# Altium project esp32-loadcell.PrjPcb
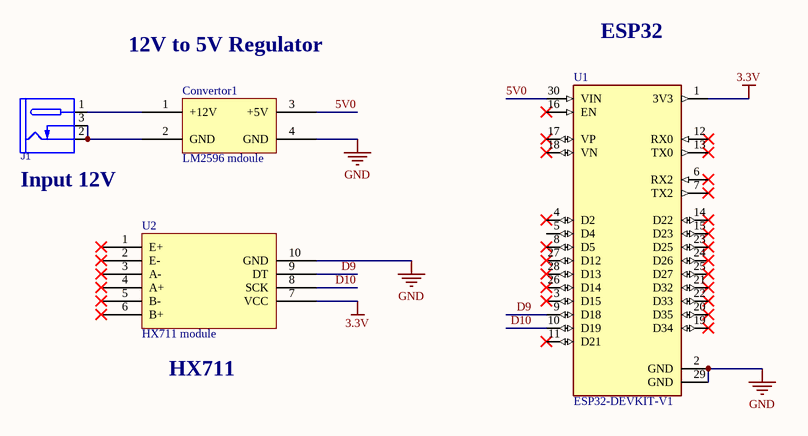
[diagram p0: Sheet1.SchDoc]
1 sheet, 4 parts. Net scope: global (net labels, ports and power ports of the same name join across sheets).
Board file: PCB1.PcbDoc

## Sheet Sheet1.SchDoc
size A; SheetNumber: 1; SheetTotal: 1

### Parts
Convertor1  LM2596 mdoule  [DC-DC LM2596]
J1  DC_POWER_JACK  [JAC_PWR2]  (value not drawn)
U1  ESP32-DEVKIT-V1  [MODULE_ESP32_DEVKIT_V1]
U2  HX711 module  [HX711]

### Nets
3.3V: U1.1(3V3) U2.7(VCC)
GND: Convertor1.4(GND) U1.2(GND) U1.29(GND) U2.10(GND)
5V0: Convertor1.3(+5V) U1.30(VIN)
D9: U1.9(D18) U2.9(DT)
D10: U1.10(D19) U2.8(SCK)
NetConvertor1_1: Convertor1.1(+12V) J1.1(TIP)
NetConvertor1_2: Convertor1.2(GND) J1.2(SLEEVE) J1.3(INSERTION_DET)

Not connected (* = marked no-connect by the designer): U1 3(D15)* 4(D2)* 5(D4) 6(RX2)* 7(TX2)* 8(D5)* 11(D21)* 12(RX0)* 13(TX0)* 14(D22)* 15(D23)* 16(EN)* 17(VP)* 18(VN)* 19(D34)* 20(D35)* 21(D32)* 22(D33)* 23(D25)* 24(D26)* 25(D27)* 26(D14)* 27(D12)* 28(D13)*; U2 1(E+)* 2(E-)* 3(A-)* 4(A+)* 5(B-)* 6(B+)*

### Notes on the sheet
- ESP32
- 12V to 5V Regulator
- (near J1) Input 12V
- (near U2) HX711

### Library data of the parts
Convertor1 = DC-DC LM2596: Voltage: 12V; Current: 3A
J1 = CONN_PWR_JACKR2: CONN, PWR JACK DC, PLUG DIAM 2.0MM RA THD; MANF: CUI STACK; MANF_P#: PJ-202A, PJ-002AH, PJ-102AH, KLDX-0202; VALUE: DC_POWER_JACK
U1 = ESP32-DEVKIT-V1: Dual core, Wi-Fi: 2.4 GHz up to 150 Mbits/s,BLE (Bluetooth Low Energy) and legacy Bluetooth, 32 bits, Up to 240 MHz; MF: Do it; Price: None; Availability: Not in stock; Package: None; MP: ESP32-DEVKIT-V1; Value: *; SnapEDA_Link: https://www.snapeda.com/parts/ESP32-DEVKIT-V1/Do+it/view-part/?ref=snap; Check_prices: https://www.snapeda.com/parts/ESP32-DEVKIT-V1/Do+it/view-part/?ref=eda
U2 = HX711